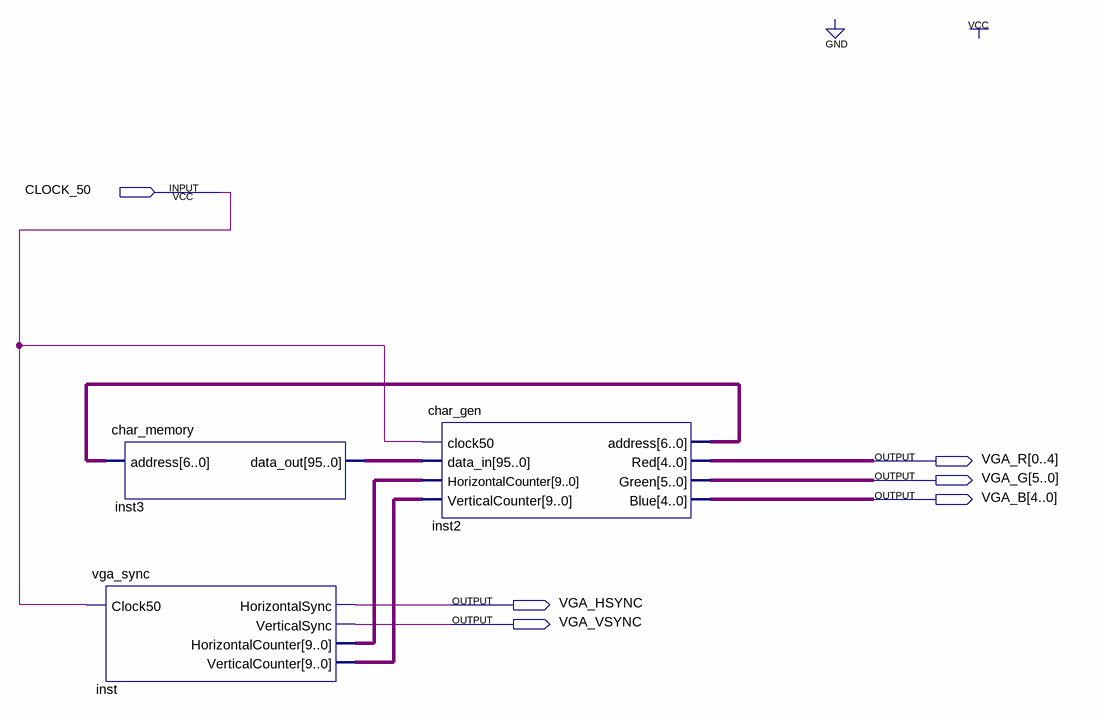
[diagram p0: schematic sheet]
// Quartus schematic vga_controller.bdf as structural Verilog: 3 symbols, 6 pins
module vga_controller (
  input  CLOCK_50,
  output [0:4] VGA_R,
  output [5:0] VGA_G,
  output [4:0] VGA_B,
  output VGA_HSYNC,
  output VGA_VSYNC
);

  wire [6:0] inst2_address;
  wire [9:0] inst_horizontalcounter, inst_verticalcounter;
  wire [95:0] inst3_data_out;

  char_memory inst3 (.address(inst2_address), .data_out(inst3_data_out));
  vga_sync inst (
    .Clock50(CLOCK_50), .HorizontalSync(VGA_HSYNC), .VerticalSync(VGA_VSYNC),
    .HorizontalCounter(inst_horizontalcounter), .VerticalCounter(inst_verticalcounter));
  char_gen inst2 (
    .clock50(CLOCK_50), .data_in(inst3_data_out), .HorizontalCounter(inst_horizontalcounter),
    .VerticalCounter(inst_verticalcounter), .address(inst2_address), .Red(VGA_R), .Green(VGA_G), .Blue(VGA_B));
endmodule
